# EAGLE schematic Robo_opcao (EAGLE 9.5.1)
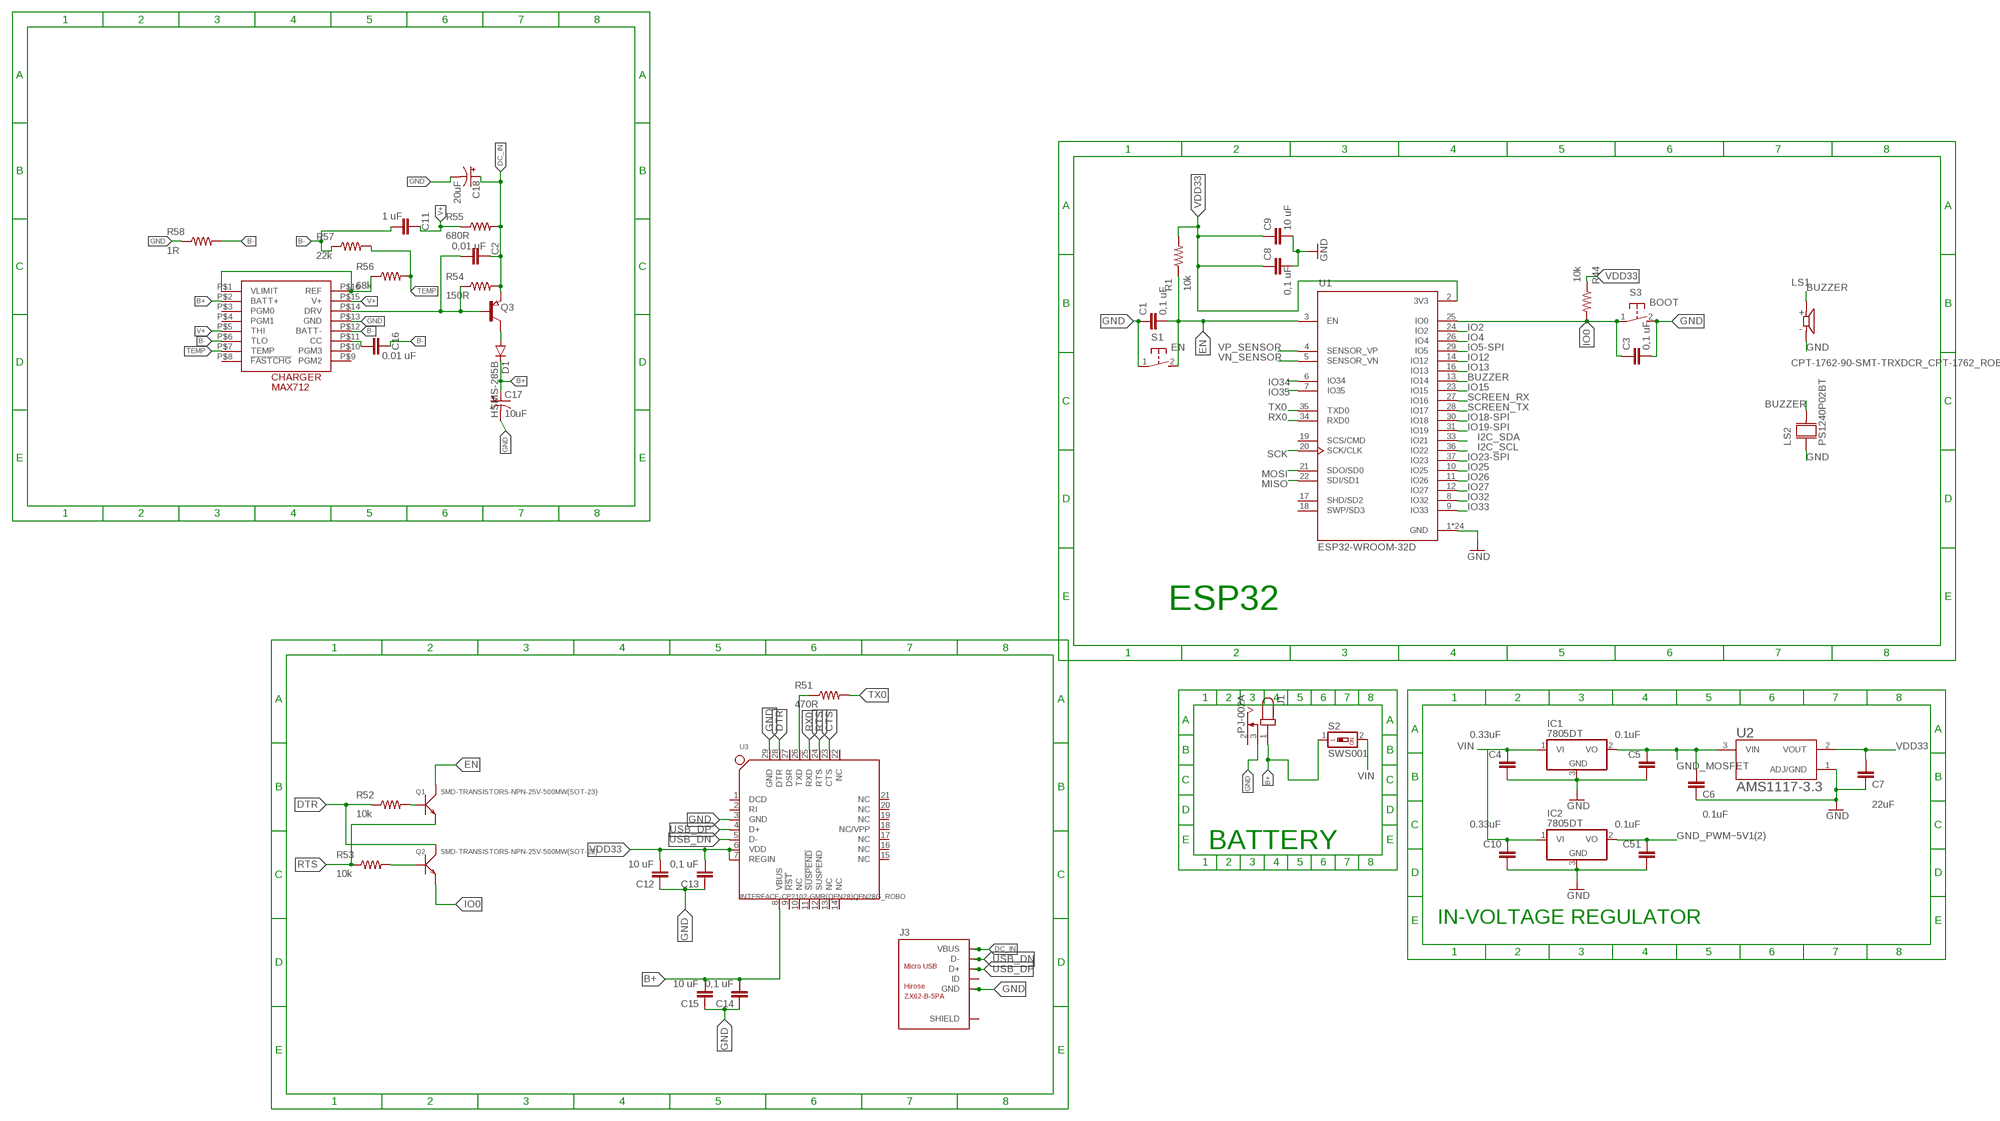
[diagram p0: schematic, sheet 1, part 1 of 2]
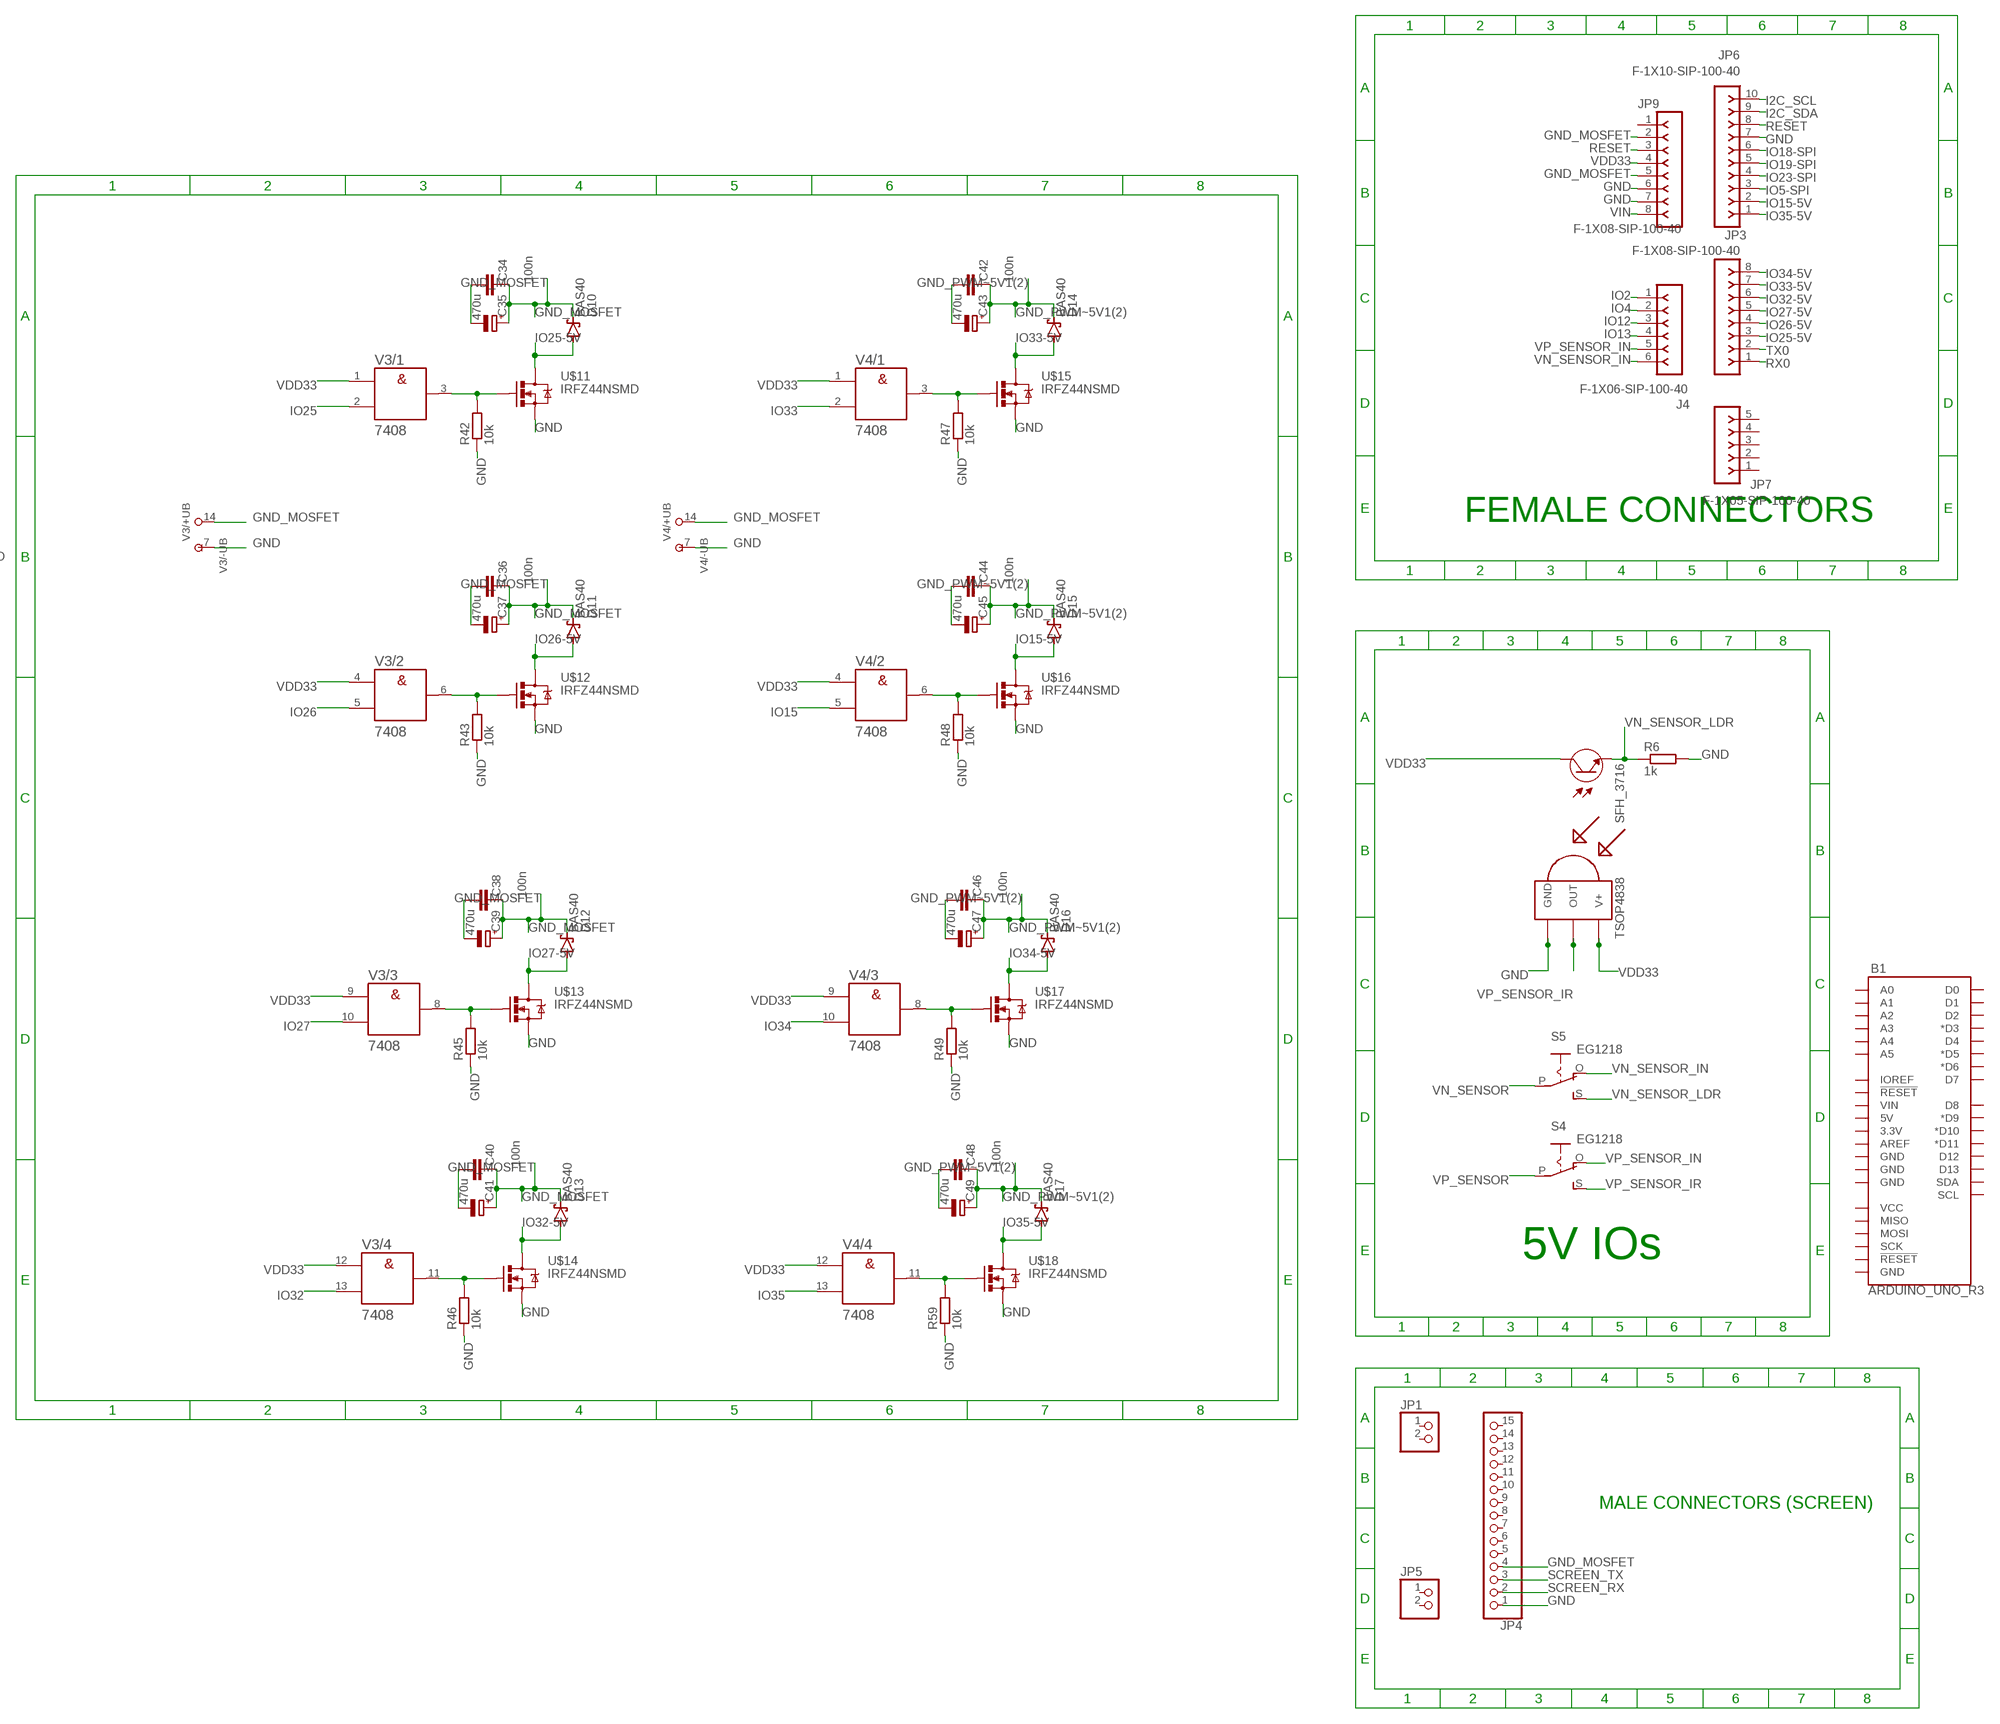
[diagram p1: schematic, sheet 1, part 2 of 2]

## Parts
B1  ARDUINO_UNO_R3  [ARDUINO_R3]
C1  0,1 uF  C-EUC0603  [C0603]
C2  0,01 uF  C-EUC0603  [C0603]
C3  0,1 uF  C-EUC0603  [C0603]
C4  0.33uF  CAP_0402  [0402]
C5  0.1uF  CAP_0402  [0402]
C6  0.1uF  CAP_0402  [0402]
C7  22uF  CAP_0402  [0402]
C8  0,1 uF  C-EUC0603  [C0603]
C9  10 uF  C-EUC0603  [C0603]
C10  0.33uF  CAP_0402  [0402]
C11  1 uF  C-EUC0603  [C0603]
C12  10 uF  C-EUC0603  [C0603]
C13  0,1 uF  C-EUC0603  [C0603]
C14  0,1 uF  C-EUC0603  [C0603]
C15  10 uF  C-EUC0603  [C0603]
C16  0.01 uF  C-EUC0603  [C0603]
C17  10uF  CPOL_0402  [0402_POL]
C18  20uF  CPOL_0402  [0402_POL]
C34  100n  CAP_0402  [0402]
C35  470u  CPOL-EU150CLZ-0810  [150CLZ-0810]
C36  100n  CAP_0402  [0402]
C37  470u  CPOL-EU150CLZ-0810  [150CLZ-0810]
C38  100n  CAP_0402  [0402]
C39  470u  CPOL-EU150CLZ-0810  [150CLZ-0810]
C40  100n  CAP_0402  [0402]
C41  470u  CPOL-EU150CLZ-0810  [150CLZ-0810]
C42  100n  CAP_0402  [0402]
C43  470u  CPOL-EU150CLZ-0810  [150CLZ-0810]
C44  100n  CAP_0402  [0402]
C45  470u  CPOL-EU150CLZ-0810  [150CLZ-0810]
C46  100n  CAP_0402  [0402]
C47  470u  CPOL-EU150CLZ-0810  [150CLZ-0810]
C48  100n  CAP_0402  [0402]
C49  470u  CPOL-EU150CLZ-0810  [150CLZ-0810]
C51  0.1uF  CAP_0402  [0402]
CHARGER  MAX712  [DIP14]
D1  HSMS-285B  [SOT323]
D10  BAS40  [SOT23]
D11  BAS40  [SOT23]
D12  BAS40  [SOT23]
D13  BAS40  [SOT23]
D14  BAS40  [SOT23]
D15  BAS40  [SOT23]
D16  BAS40  [SOT23]
D17  BAS40  [SOT23]
IC1  7805DT  [TO252]
IC2  7805DT  [TO252]
J1  PJ-002A  [CUI_PJ-002A]
J3  ZX62-B-5PA  [ZX62-B-5PA(11)]
J4  F-1X06-SIP-100-40  [SIP-100-06-40]
JP1  PINHD-1X2_2.54-SMD  [1X02SMD]
JP3  F-1X08-SIP-100-40  [SIP-100-08-40]
JP4  PINHD-1X15_2.54-SMD  [1X15SMD]
JP5  PINHD-1X2_2.54-SMD  [1X02SMD]
JP6  F-1X10-SIP-100-40  [SIP-100-10-40]
JP7  F-1X05-SIP-100-40  [SIP-100-05-40]
JP9  F-1X08-SIP-100-40  [SIP-100-08-40]
LS1  CPT-1762-90-SMT-TRXDCR_CPT-1762_ROBO  [XDCR_CPT-1762_ROBO]
LS2  PS1240P02BT  [XDCR_PS1240P02BT]
Q1  SMD-TRANSISTORS-NPN-25V-500MW(SOT-23)  [SOT-23]
Q2  SMD-TRANSISTORS-NPN-25V-500MW(SOT-23)  [SOT-23]
Q3  PNP-TRANSISTOR_SOT23  [SOT23]
Q4  SFH_3716  [TRANS_SFH_3716]
Q5  TSOP4838  [TSOP18XX]
R1  10k  RES_0402  [0402]
R6  1k  R-EU_M0805  [M0805]
R42  10k  R-EU_M0805  [M0805]
R43  10k  R-EU_M0805  [M0805]
R44  10k  RES_0402  [0402]
R45  10k  R-EU_M0805  [M0805]
R46  10k  R-EU_M0805  [M0805]
R47  10k  R-EU_M0805  [M0805]
R48  10k  R-EU_M0805  [M0805]
R49  10k  R-EU_M0805  [M0805]
R51  470R  RES_0402  [0402]
R52  10k  RES_0402  [0402]
R53  10k  RES_0402  [0402]
R54  150R  RES_0402  [0402]
R55  680R  RES_0402  [0402]
R56  68k  RES_0402  [0402]
R57  22k  RES_0402  [0402]
R58  1R  RES_0402  [0402]
R59  10k  R-EU_M0805  [M0805]
S1  EN  DTSM-3  [DTSM-3]
S2  SWS001  [SMS-001]
S3  BOOT  DTSM-3  [DTSM-3]
S4  EG1218  [EG1218_ROBO]
S5  EG1218  [EG1218_ROBO]
U1  ESP32-WROOM-32D  [MODULE_ESP32-WROOM-32D]
U2  AMS1117-3.3  [SOT229P700X180-4N]
U3  INTERFACE-CP2102-GMR(QFN28)QFN28G_ROBO  [QFN28G_0.5-5X5MM_ROBO]
U$11  IRFZ44NSMD  [SMD]
U$12  IRFZ44NSMD  [SMD]
U$13  IRFZ44NSMD  [SMD]
U$14  IRFZ44NSMD  [SMD]
U$15  IRFZ44NSMD  [SMD]
U$16  IRFZ44NSMD  [SMD]
U$17  IRFZ44NSMD  [SMD]
U$18  IRFZ44NSMD  [SMD]
V3  7408  [DIL14_FT]
V4  7408  [DIL14_FT]

## Nets
B+ [x]: C14.2 C15.2 C17.P+(+) CHARGER.P$2(BATT+) D1.3(C) J1.1 S2.1 U3.8(VBUS)
B-: C11.2 C16.1 CHARGER.P$6(TLO) CHARGER.P$12(BATT-) R57.1 R58.2
BUZZER: LS1.P LS2.2 U1.13(IO14)
CTS: U3.23(CTS)
DC_IN [x]: C2.1 C18.P+(+) J3.1(VBUS) Q3.2(E) R54.2 R55.2
DTR [x]: Q2.3(C) R52.1 U3.28(DTR)
EN: C1.2 Q1.3(C) R1.1 S1.2 U1.3(EN)
GND [x]: C1.1 C3.2 C4.1 C5.1 C6.2 C7.2 C8.2 C9.2 C10.1 C12.1 C13.1 C14.1 C15.1 C17.P-(-) C18.P-(-) C51.1 CHARGER.P$13(GND) IC1.3(GND) IC2.3(GND) J1.3 J3.5(GND) JP4.1 JP6.7 JP9.6 JP9.7 LS1.N LS2.1 Q5.GND R6.2 R42.1 R43.1 R45.1 R46.1 R47.1 R48.1 R49.1 R58.1 R59.1 S1.1 S3.2 U1.1(GND) U1.15(GND) U1.38(GND) U1.39_1(GND) U1.39_2(GND) U1.39_3(GND) U1.39_4(GND) U1.39_5(GND) U1.39_6(GND) U1.39_7(GND) U1.39_8(GND) U1.39_9(GND) U1.39_10(GND) U1.39_11(GND) U1.39_12(GND) U1.39_13(GND) U1.39_14(GND) U1.39_15(GND) U1.39_16(GND) U1.39_17(GND) U1.39_18(GND) U1.39_19(GND) U1.39_20(GND) U1.39_21(GND) U2.1(ADJ/GND) U3.3(GND) U3.29(GND) U$11.3(S) U$12.3(S) U$13.3(S) U$14.3(S) U$15.3(S) U$16.3(S) U$17.3(S) U$18.3(S) V3.7(/-UB:-UB) V4.7(/-UB:-UB)
GND_MOSFET: C5.2 C6.1 C34.2 C35.+ C36.2 C37.+ C38.2 C39.+ C40.2 C41.+ D10.3(C) D11.3(C) D12.3(C) D13.3(C) IC1.2(VO) JP4.4 JP9.2 JP9.5 U2.3(VIN) V3.14(/+UB:+UB) V4.14(/+UB:+UB)
GND_PWM~5V1(2): C42.2 C43.+ C44.2 C45.+ C46.2 C47.+ C48.2 C49.+ C51.2 D14.3(C) D15.3(C) D16.3(C) D17.3(C) IC2.2(VO)
I2C_SCL: JP6.10 U1.36(IO22)
I2C_SDA: JP6.9 U1.33(IO21)
IO0: C3.1 Q2.2(E) R44.2 S3.1 U1.25(IO0)
IO2: J4.1 U1.24(IO2)
IO4: J4.2 U1.26(IO4)
IO5-SPI: JP6.3 U1.29(IO5)
IO12: J4.3 U1.14(IO12)
IO13: J4.4 U1.16(IO13)
IO15: U1.23(IO15) V4.5(/2:B)
IO15-5V: D15.1(A) JP6.2 U$16.2(D)
IO18-SPI: JP6.6 U1.30(IO18)
IO19-SPI: JP6.5 U1.31(IO19)
IO23-SPI: JP6.4 U1.37(IO23)
IO25: U1.10(IO25) V3.2(/1:B)
IO25-5V: D10.1(A) JP3.3 U$11.2(D)
IO26: U1.11(IO26) V3.5(/2:B)
IO26-5V: D11.1(A) JP3.4 U$12.2(D)
IO27: U1.12(IO27) V3.10(/3:B)
IO27-5V: D12.1(A) JP3.5 U$13.2(D)
IO32: U1.8(IO32) V3.13(/4:B)
IO32-5V: D13.1(A) JP3.6 U$14.2(D)
IO33: U1.9(IO33) V4.2(/1:B)
IO33-5V: D14.1(A) JP3.7 U$15.2(D)
IO34: U1.6(IO34) V4.10(/3:B)
IO34-5V: D16.1(A) JP3.8 U$17.2(D)
IO35: U1.7(IO35) V4.13(/4:B)
IO35-5V: D17.1(A) JP6.1 U$18.2(D)
MISO: U1.22(SDI/SD1)
MOSI: U1.21(SDO/SD0)
N$3 [x]: R51.1 U3.26(TXD)
N$12: C34.1 C35.-
N$13: C36.1 C37.-
N$14: Q1.1(B) R52.2
N$15: C38.1 C39.-
N$16: C40.1 C41.-
N$17: C42.1 C43.-
N$18: C44.1 C45.-
N$19: C46.1 C47.-
N$20: C48.1 C49.-
N$25: Q2.1(B) R53.2
N$26: C2.2 CHARGER.P$14(DRV) Q3.1(B) R54.1
N$28: R42.2 U$11.1(G) V3.3(/1:Y)
N$30: D1.1(A) Q3.3(C)
N$31: C16.2 CHARGER.P$11(CC)
N$32: CHARGER.P$1(VLIMIT) CHARGER.P$16(REF) R56.1
N$33: R43.2 U$12.1(G) V3.6(/2:Y)
N$34: R45.2 U$13.1(G) V3.8(/3:Y)
N$36: R46.2 U$14.1(G) V3.11(/4:Y)
N$37: R47.2 U$15.1(G) V4.3(/1:Y)
N$38: R48.2 U$16.1(G) V4.6(/2:Y)
N$39: R49.2 U$17.1(G) V4.8(/3:Y)
N$40: R59.2 U$18.1(G) V4.11(/4:Y)
RESET: JP6.8 JP9.3
RTS [x]: Q1.2(E) R53.1 U3.24(RTS)
RX0 [x]: JP3.1 U1.34(RXD0) U3.25(RXD)
SCK: U1.20(SCK/CLK)
SCREEN_RX: JP4.2 U1.27(IO16)
SCREEN_TX: JP4.3 U1.28(IO17)
TEMP: CHARGER.P$7(TEMP) R56.2 R57.2
TX0: JP3.2 R51.2 U1.35(TXD0)
USB_DN [x]: J3.2(D-) U3.5(D-)
USB_DP [x]: J3.3(D+) U3.4(D+)
V+: C11.1 CHARGER.P$5(THI) CHARGER.P$15(V+) R55.1
VDD33 [x]: C7.1 C8.1 C9.1 C12.2 C13.2 JP9.4 Q4.1(C) Q5.VCC(V+) R1.2 R44.1 U1.2(3V3) U2.2(VOUT) U3.6(VDD) U3.7(REGIN) V3.1(/1:A) V3.4(/2:A) V3.9(/3:A) V3.12(/4:A) V4.1(/1:A) V4.4(/2:A) V4.9(/3:A) V4.12(/4:A)
VIN: C4.2 IC1.1(VI) JP9.8 S2.2
VIN1: C10.2 IC2.1(VI)
VN_SENSOR: S5.P U1.5(SENSOR_VN)
VN_SENSOR_IN: J4.6 S5.O
VN_SENSOR_LDR: Q4.2(E) R6.1 S5.S
VP_SENSOR: S4.P U1.4(SENSOR_VP)
VP_SENSOR_IN: J4.5 S4.O
VP_SENSOR_IR: Q5.OUT S4.S
Unconnected: B1.3.3V B1.5V B1.A0 B1.A1 B1.A2 B1.A3 B1.A4 B1.A5 B1.AREF B1.D0 B1.D1 B1.D2 B1.D3(*D3) B1.D4 B1.D5(*D5) B1.D6(*D6) B1.D7 B1.D8 B1.D9(*D9) B1.D10(*D10) B1.D11(*D11) B1.D12 B1.D13 B1.GND@1(GND) B1.GND@2(GND) B1.GND@3(GND) B1.GND@4(GND) B1.IOREF B1.MISO B1.MOSI B1.RESET@1(!RESET!) B1.RESET@2(!RESET!) B1.SCK B1.SCL B1.SDA B1.VCC B1.VIN CHARGER.P$3(PGM0) CHARGER.P$4(PGM1) CHARGER.P$8(!FASTCHG!) CHARGER.P$9(PGM2) CHARGER.P$10(PGM3) J1.2 J3.4(ID) J3.SH1(SHIELD) J3.SH2(SHIELD) J3.SH3(SHIELD) J3.SH4(SHIELD) J3.SH5(SHIELD) J3.SH6(SHIELD) JP1.1 JP1.2 JP4.5 JP4.6 JP4.7 JP4.8 JP4.9 JP4.10 JP4.11 JP4.12 JP4.13 JP4.14 JP4.15 JP5.1 JP5.2 JP7.1 JP7.2 JP7.3 JP7.4 JP7.5 JP9.1 U1.17(SHD/SD2) U1.18(SWP/SD3) U1.19(SCS/CMD) U3.1(DCD) U3.2(RI) U3.9(!RST) U3.10(NC) U3.11(!SUSPEND) U3.12(SUSPEND) U3.13(NC) U3.14(NC) U3.15(NC) U3.16(NC) U3.17(NC) U3.18(NC/VPP) U3.19(NC) U3.20(NC) U3.21(NC) U3.22(NC) U3.27(DSR)

## Notes on the sheet
- FEMALE CONNECTORS
- ESP32
- BATTERY
- 5V IOs
- IN-VOLTAGE REGULATOR
- MALE CONNECTORS (SCREEN)

## Library data of the parts
B1 = SparkFun-Boards:ARDUINO_UNO_R3: Arduino R3 Footprint with SPI header Arduino Uno R3 Compatible Footprint. Matches PCB size of the original board. SparkFun Products: SAMD21 Dev Breakout <https://www.sparkfun.com/products/13672> RedBoard <https://www.sparkfun.com/products/12757> R3 Stackable Headers <https://www.sparkfun.com/products/11417>
C1-C3 C8 C9 C11-C16 = rcl:C-EU: CAPACITOR, European symbol; SPICEPREFIX: C
C4-C7 C10 C34 C36 C38 C40 C42 C44 C46 C48 C51 = Perfect_0402:CAP_0402: 0402 (1005 Metric) Nick Garner - TeleSense
C17 C18 = Perfect_0402:CPOL_0402: 0402 (1005 Metric) Nick Garner - TeleSense
C35 C37 C39 C41 C43 C45 C47 C49 = rcl:CPOL-EU: POLARIZED CAPACITOR, European symbol; SPICEPREFIX: C
CHARGER = MAX712:MAX712; AVAILABILITY: Unavailable; DESCRIPTION: Charger IC Multi-Chemistry 16-SOIC; MF: Maxim Integrated; MP: MAX712; PACKAGE: SOIC-16 Maxim Integrated; PRICE: None
D1 = avago:HSMS-285B: Surface Mount Microwave Schottky Detector Diodes Source: Data sheet <http://www.farnell.com/datasheets/461166.pdf>
D10-D17 = diode:BAS40: Silicon Schottky Diodes General-purpose diode for high-speed switching
IC1 IC2 = linear:78*: Positive VOLTAGE REGULATOR Source: http://cache.national.com/ds/LM/LM78L05.pdf http://www.fairchildsemi.com/ds/LM/LM7805.pdf
J1 = PJ-002A:PJ-002A: 2.0 mm Center Pin, 2.5 A, Right Angle, Through Hole, Dc Power Jack Connector Check prices <https://pricing.snapeda.com/parts/PJ-002A/CUI%20Devices/view-part?ref=eda>; AVAILABILITY: Good; CUI_PURCHASE_URL: https://www.cuidevices.com/product/interconnect/connectors/dc-power-connectors/jacks/pj-002a?utm_source=snapeda.com&utm_medium=referral&utm_campaign=snapedaBOM; DESCRIPTION: 2.0 x 6.5 mm, 2.5 A, Horizontal, Through Hole, Dc Power Jack Connector; MF: CUI Devices; MP: PJ-002A; PACKAGE: None; PRICE: None; PURCHASE-URL: https://pricing.snapeda.com/search/part/PJ-002A/?ref=eda
J3 = ZX62-B-5PA:ZX62-B-5PA; DESCRIPTION: USB - micro B USB 2.0 Receptacle Connector 5 Position Surface Mount, Right Angle; DIGI-KEY_PART_NUMBER: H11579CT-ND; MF: Hirose; MP: ZX62-B-5PA; PACKAGE: None
J4 = con-headers-jp(1):F-1X06-: FEMALE HEADER
JP1 JP5 = pinhead-1:PINHD-1X2: PIN HEADER
JP3 JP9 = con-headers-jp(1):F-1X08-: FEMALE HEADER
JP4 = pinhead-1:PINHD-1X15: PIN HEADER
JP6 = con-headers-jp(1):F-1X10-: FEMALE HEADER
JP7 = con-headers-jp(1):F-1X05-: FEMALE HEADER
LS1 = CPT-1762-90-SMT-TR:CPT-1762-90-SMT-TR: 17 mm, 12 Vp-p, 90 dB, Surface Mount, Piezo Audio Transducer Buzzer Check prices <https://pricing.snapeda.com/parts/CPT-1762-90-SMT-TR/CUI%20Devices/view-part?ref=eda>
LS2 = PS1240P02BT:PS1240P02BT: Buzzers Transducer, Externally Driven Piezo 3V 4kHz 60dB @ 3V, 10cm Through Hole PC Pins Check prices <https://pricing.snapeda.com/parts/PS1240P02BT/TDK%20Corporation/view-part?ref=eda>; AVAILABILITY: Warning; DESCRIPTION: Buzzers Transducer, Externally Driven Piezo 3V 4kHz 60dB @ 3V, 10cm Through Hole PC Pins; MF: TDK Corporation; MP: PS1240P02BT; PACKAGE: 2020 TDK; PRICE: None; PURCHASE-URL: https://pricing.snapeda.com/search/part/PS1240P02BT/?ref=eda
Q1 Q2 = SMD-TRANSISTORS-NPN-25V-500MW_SOT-23_:SMD-TRANSISTORS-NPN-25V-500MW(SOT-23): 305010017; AVAILABILITY: Unavailable; DESCRIPTION: Bipolar (BJT) Transistor NPN 25V 1.5A 100MHz 625mW Surface Mount SOT-23; MF: Recom Power; MP: S8050; PACKAGE: SOT-23 Micro Commercial; PRICE: None
Q3 = semicon-smd-ipc:PNP-TRANSISTOR_: PNP TRANSISTOR
Q4 = SFH_3716:SFH_3716: CHIPLED®, Silicon NPN Phototransistor with Vλ Characteristics; DESCRIPTION: Phototransistors 570nm Top View 0805 (2012 Metric); DIGI-KEY_PART_NUMBER: SFH3716-ND; MF: OSRAM Opto; MP: SFH 3716; PACKAGE: 0805 OSRAM Opto Semiconductors Inc.
Q5 = tsop:TSOP4838: IR Receiver and Demodulator
R1 R44 R51-R58 = Perfect_0402:RES_0402: 0402 (1005 Metric) Nick Garner - TeleSense
R6 R42 R43 R45-R49 R59 = rcl:R-EU_: RESISTOR, European symbol; SPICEPREFIX: R
S1 S3 = switch-tact:DTSM-3
S2 = smd-special:SWS001: SMD Dip Switch 1 pol.
S4 S5 = EG1218(1):EG1218: SLIDING SWITCH 0.1" spacing through hole, vertical SPDT slide switch http://www.ladyada.net/library/pcb/eaglelibrary.html Check prices <https://pricing.snapeda.com/parts/EG1218/E-Switch/view-part?ref=eda>
U1 = ESP32-WROOM-32D:ESP32-WROOM-32D: Bluetooth, WiFi 802.11b/g/n, Bluetooth v4.2 + EDR, Class 1, 2 and 3 Transceiver Module 2.4GHz ~ 2.5GHz Integrated, Trace Surface Mount; AVAILABILITY: Unavailable; DESCRIPTION: Bluetooth, WiFi 802.11b/g/n, Bluetooth v4.2 +EDR, Class 1, 2 and 3 Transceiver Module 2.4GHz ~ 2.5GHz Integrated, Trace Surface Mount; MF: Espressif Systems; MP: ESP32-WROOM-32D; PACKAGE: Module Espressif Systems; PRICE: None
U2 = AMS1117-3.3:AMS1117-3.3: Sot223/Pkg 1-Amp 3.3-Volt Low Drop Out Voltage Regulatator; AVAILABILITY: Unavailable; DESCRIPTION: Sot223/Pkg 1-Amp 3.3-Volt Low Drop Out Voltage Regulatator; MF: Advanced Monolithic Systems; MP: AMS1117-3.3; PACKAGE: None; PRICE: None
U3 = INTERFACE-CP2102-GMR_QFN28_:INTERFACE-CP2102-GMR(QFN28): 310070003 Check prices <https://snapeda.com/parts/CP2102-GMR/Silicon/view-part/?ref=eda>
U$11-U$18 = IRFZ44N:IRFZ44N
V3 V4 = 74ttl-din_modified:74*08: Quad 2-input AND gate

## Net classes
0 default: width 0.61 mm, drill 0.61 mm, clearance 0.254 mm
1 x: width 0.203 mm, drill 0.508 mm, clearance 0.254 mm